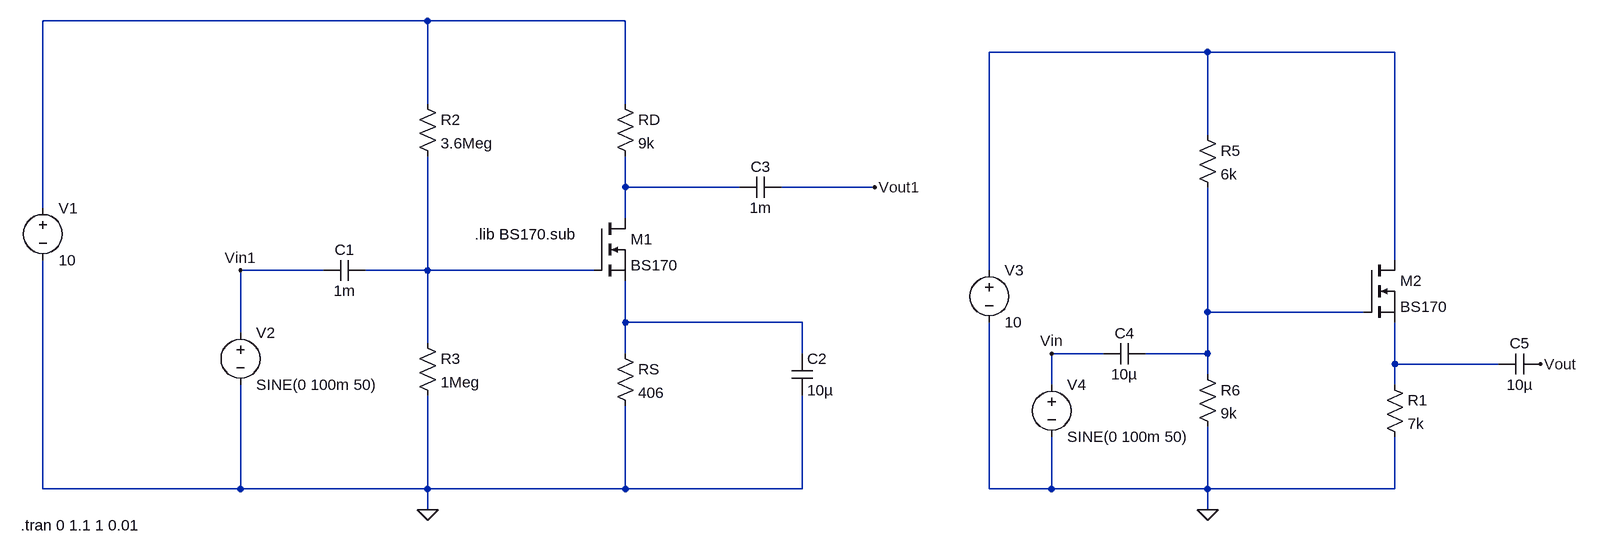
[diagram p0: schematic CSC circuit amplifier.asc]
CSC circuit amplifier.asc, the LTspice schematic file:
Version 4
SHEET 1 2024 680
WIRE 64 -256 -528 -256
WIRE 368 -256 64 -256
WIRE 1264 -208 928 -208
WIRE 1552 -208 1264 -208
WIRE 64 -128 64 -256
WIRE 368 -128 368 -256
WIRE 1264 -80 1264 -208
WIRE 368 0 368 -48
WIRE 544 0 368 0
WIRE 752 0 608 0
WIRE -528 32 -528 -256
WIRE 368 48 368 0
WIRE 1552 112 1552 -208
WIRE -96 128 -224 128
WIRE 64 128 64 -48
WIRE 64 128 -32 128
WIRE 320 128 64 128
WIRE 928 128 928 -208
WIRE 1264 192 1264 0
WIRE 1504 192 1264 192
WIRE 368 208 368 144
WIRE 640 208 368 208
WIRE -224 224 -224 128
WIRE 64 240 64 128
WIRE 368 256 368 208
WIRE 640 256 640 208
WIRE 1104 256 1024 256
WIRE 1264 256 1264 192
WIRE 1264 256 1168 256
WIRE 1552 272 1552 208
WIRE 1712 272 1552 272
WIRE 1264 288 1264 256
WIRE 1024 304 1024 256
WIRE 1552 304 1552 272
WIRE -528 464 -528 112
WIRE -224 464 -224 304
WIRE -224 464 -528 464
WIRE 64 464 64 320
WIRE 64 464 -224 464
WIRE 368 464 368 336
WIRE 368 464 64 464
WIRE 640 464 640 320
WIRE 640 464 368 464
WIRE 928 464 928 208
WIRE 1024 464 1024 384
WIRE 1024 464 928 464
WIRE 1264 464 1264 368
WIRE 1264 464 1024 464
WIRE 1552 464 1552 384
WIRE 1552 464 1264 464
WIRE 64 496 64 464
WIRE 1264 496 1264 464
FLAG 64 496 0
FLAG 1264 496 0
FLAG 1776 272 Vout
FLAG 1024 256 Vin
FLAG -224 128 Vin1
FLAG 752 0 Vout1
SYMBOL nmos 320 48 R0
SYMATTR InstName M1
SYMATTR Value BS170
SYMATTR Prefix X
SYMBOL voltage -528 16 R0
WINDOW 123 0 0 Left 0
WINDOW 39 0 0 Left 0
SYMATTR InstName V1
SYMATTR Value 10
SYMBOL voltage -224 208 R0
WINDOW 123 0 0 Left 0
WINDOW 39 0 0 Left 0
SYMATTR InstName V2
SYMATTR Value SINE(0 100m 50)
SYMBOL res 352 -144 R0
SYMATTR InstName RD
SYMATTR Value 9k
SYMBOL res 48 -144 R0
SYMATTR InstName R2
SYMATTR Value 3.6Meg
SYMBOL cap -32 112 R90
WINDOW 0 0 32 VBottom 2
WINDOW 3 32 32 VTop 2
SYMATTR InstName C1
SYMATTR Value 1m
SYMBOL res 48 224 R0
SYMATTR InstName R3
SYMATTR Value 1Meg
SYMBOL res 352 240 R0
SYMATTR InstName RS
SYMATTR Value 406
SYMBOL cap 624 256 R0
SYMATTR InstName C2
SYMATTR Value 10µ
SYMBOL cap 608 -16 R90
WINDOW 0 0 32 VBottom 2
WINDOW 3 32 32 VTop 2
SYMATTR InstName C3
SYMATTR Value 1m
SYMBOL nmos 1504 112 R0
SYMATTR InstName M2
SYMATTR Value BS170
SYMATTR Prefix X
SYMBOL res 1536 288 R0
SYMATTR InstName R1
SYMATTR Value 7k
SYMBOL res 1248 -96 R0
SYMATTR InstName R5
SYMATTR Value 6k
SYMBOL res 1248 272 R0
SYMATTR InstName R6
SYMATTR Value 9k
SYMBOL voltage 928 112 R0
WINDOW 123 0 0 Left 0
WINDOW 39 0 0 Left 0
SYMATTR InstName V3
SYMATTR Value 10
SYMBOL voltage 1024 288 R0
WINDOW 123 0 0 Left 0
WINDOW 39 0 0 Left 0
SYMATTR InstName V4
SYMATTR Value SINE(0 100m 50)
SYMBOL cap 1168 240 R90
WINDOW 0 0 32 VBottom 2
WINDOW 3 32 32 VTop 2
SYMATTR InstName C4
SYMATTR Value 10µ
SYMBOL cap 1776 256 R90
WINDOW 0 0 32 VBottom 2
WINDOW 3 32 32 VTop 2
SYMATTR InstName C5
SYMATTR Value 10µ
TEXT 136 72 Left 2 !.lib BS170.sub
TEXT -562 520 Left 2 !.tran 0 1.1 1 0.01

The netlist it stands for:
* CSC circuit amplifier.asc
XM1 N003 N004 N006 BS170  ; pins D G S
V1 N001 0 10
V2 Vin1 0 SINE(0 100m 50)
RD N001 N003 9k
R2 N001 N004 3.6Meg
C1 N004 Vin1 1m
R3 N004 0 1Meg
RS N006 0 406
C2 N006 0 10µ
C3 Vout1 N003 1m
XM2 N002 N005 N007 BS170  ; pins D G S
R1 N007 0 7k
R5 N002 N005 6k
R6 N005 0 9k
V3 N002 0 10
V4 Vin 0 SINE(0 100m 50)
C4 N005 Vin 10µ
C5 Vout N007 10µ
.lib BS170.sub
.tran 0 1.1 1 0.01
.backanno
.end